# Altium schematic sheet SoM.SchDoc
size A3; SheetNumber: 1; SheetTotal: 1; PageSetup: Record=PageOptions|CenterHorizontal=True|CenterVertical=True|PrintScale=0.97|XCorrection=1.00|YCorrection=1.00|PrintKind=1|BorderSize=5000000|LeftOffset=0|BottomOffset=0|Orientation=2|PaperLength=2970|PaperWidth=2100|Scale=100|PaperSource=7|PrintQuality=600|MediaType=1|DitherType=10|PaperKind=A4|PrintScaleMode=1
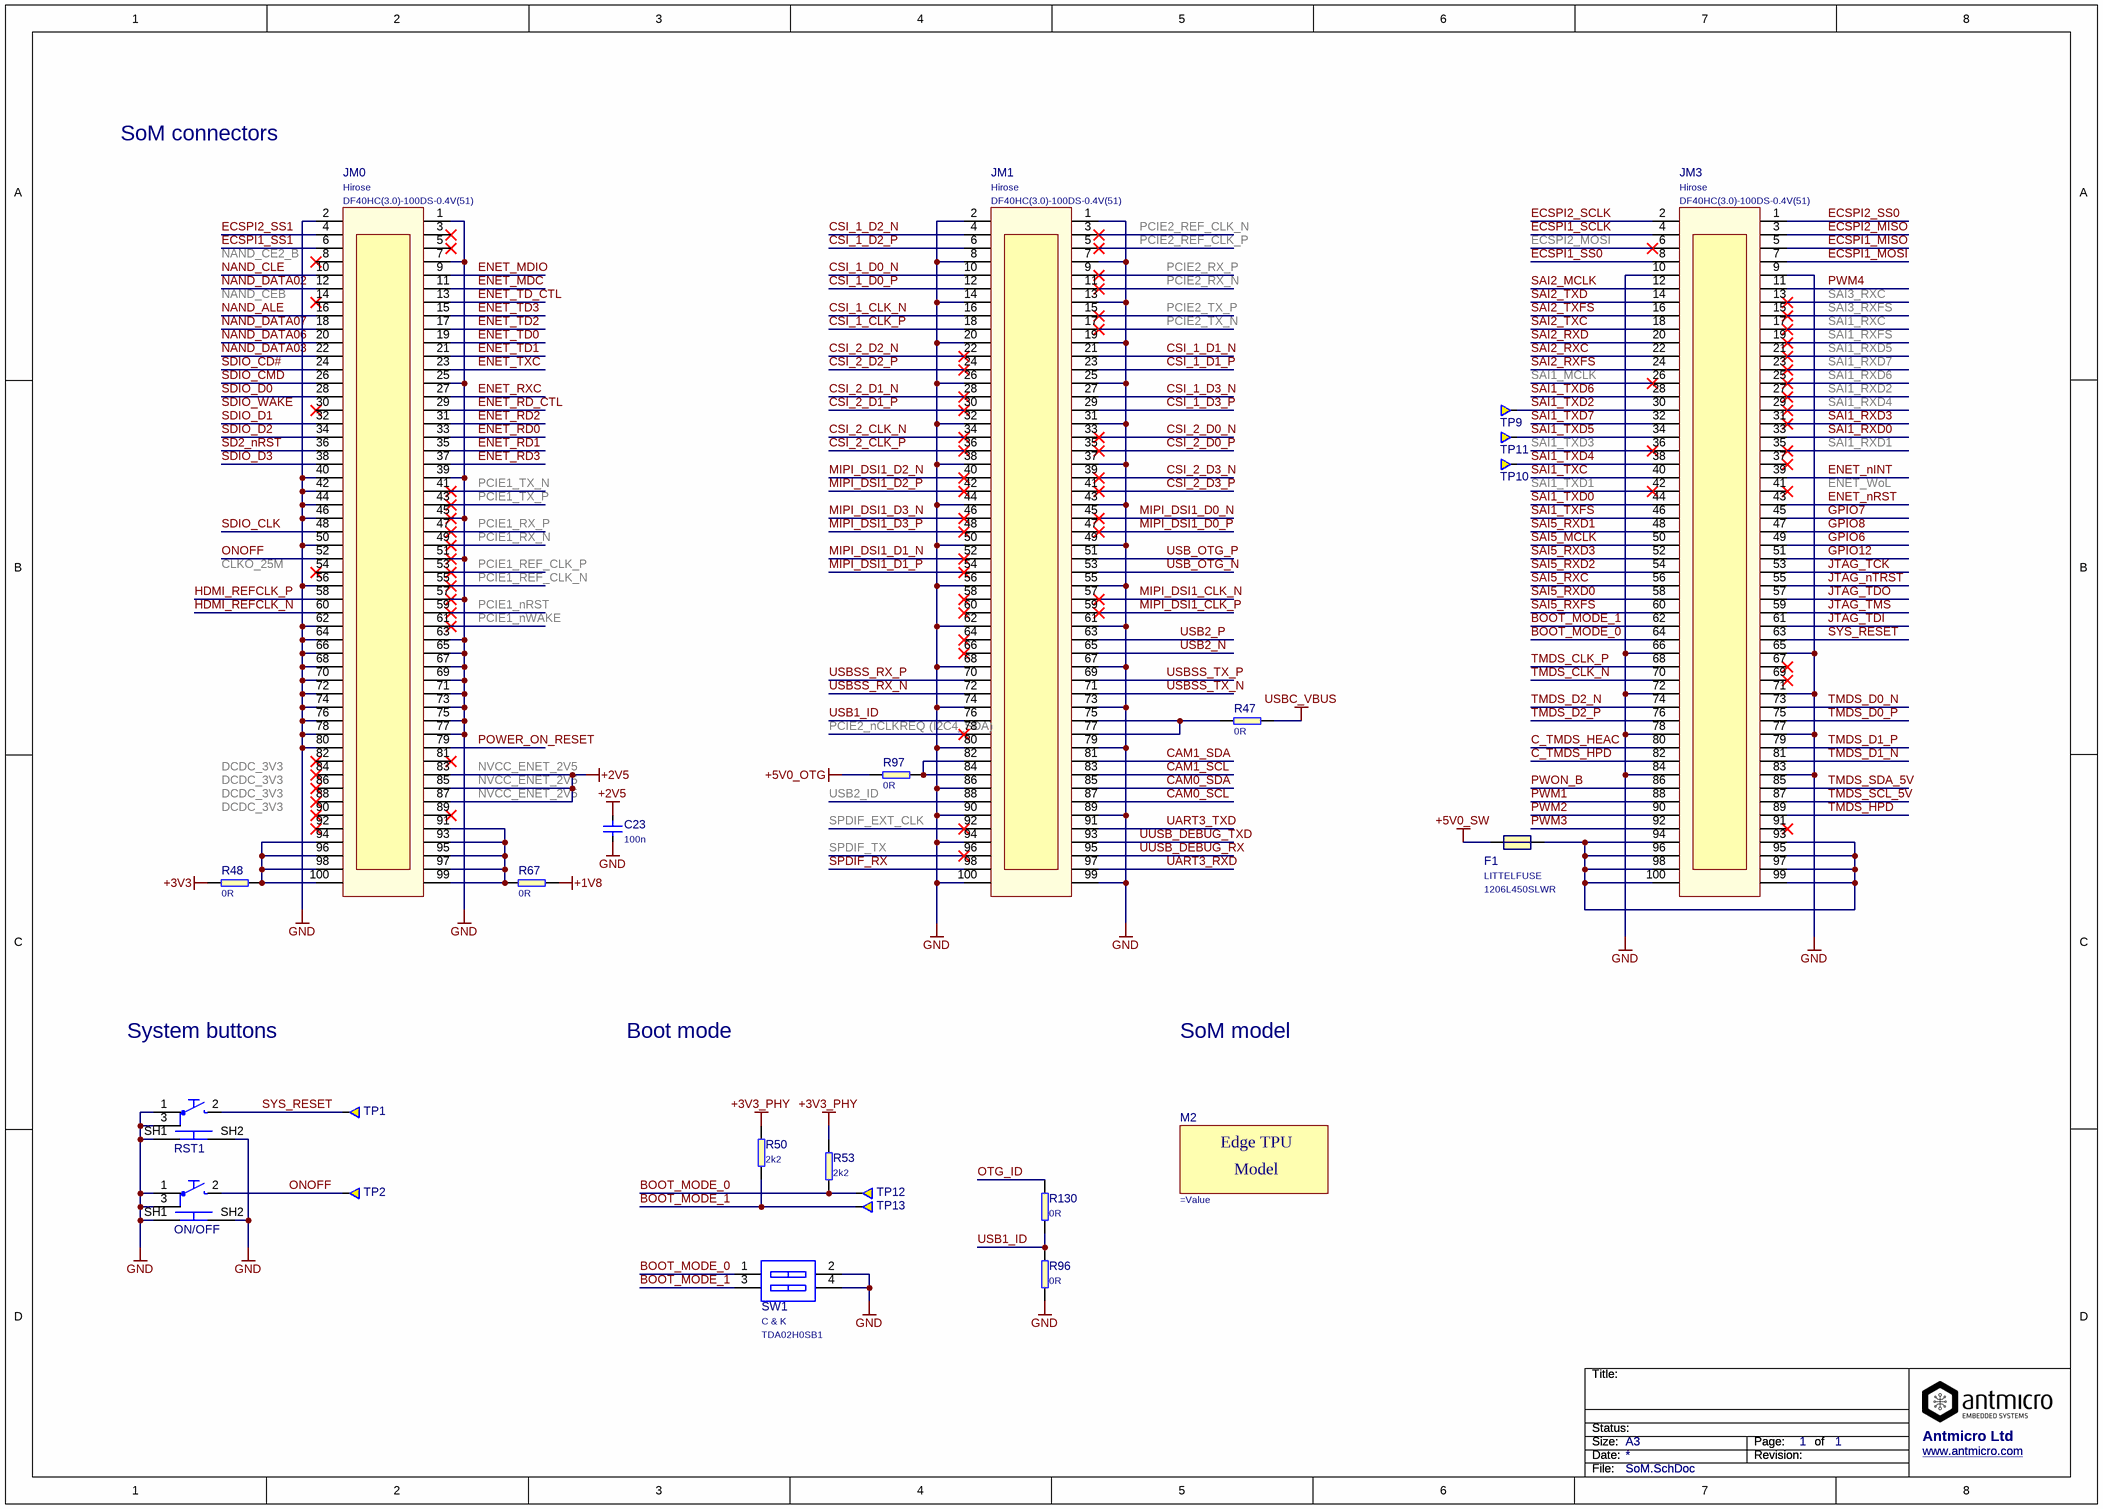
[diagram p0: SoM.SchDoc]

## Parts
C23  100n  [C_0402]
F1  PartNumber: 1206L450SLWR  Manufacturer: LITTELFUSE  [Fuse-1206]  (hidden comment: Value)
JM0  DF40HC(3.0)-100DS-0.4V(51)  Manufacturer: Hirose  [DF40HC(3.0)-100DS-0.4V(51)]
JM1  DF40HC(3.0)-100DS-0.4V(51)  Manufacturer: Hirose  [DF40HC(3.0)-100DS-0.4V(51)]
JM3  DF40HC(3.0)-100DS-0.4V(51)  Manufacturer: Hirose  [DF40HC(3.0)-100DS-0.4V(51)]
M2  (no value)  [Edge-TPU-SOM-model]
ON/OFF  TL3340AF160QG  [TL3340AF160QG]  (value not drawn)
R47  0R  [0402]
R48  0R  [0805]
R50  2k2  [0402]
R53  2k2  [0402]
R67  0R  [0805]
R96  0R  [0402]
R97  0R  [0402]
R130  0R  [0402]
RST1  TL3340AF160QG  [TL3340AF160QG]  (value not drawn)
SW1  TDA02H0SB1  Manufacturer: C & K  [TDA02H0SB1]
TP1  Testpad  [TP-R-1.5]  (value not drawn)  (no BOM)
TP2  Testpad  [TP-R-1.5]  (value not drawn)  (no BOM)
TP9  Testpad  [TP-R-1.5]  (value not drawn)  (no BOM)
TP10  Testpad  [TP-R-1.5]  (value not drawn)  (no BOM)
TP11  Testpad  [TP-R-1.5]  (value not drawn)  (no BOM)
TP12  Testpad  [TP-R-1.5]  (value not drawn)  (no BOM)
TP13  Testpad  [TP-R-1.5]  (value not drawn)  (no BOM)

## Nets
+1V8: R67.2
+3V3: R48.2
+3V3_PHY: R50.2 R53.2
+5V0_OTG: R97.2
+5V0_SW: F1.1
GND: C23.2 JM0.1(ETH_VDD) JM0.2 JM0.7(ETH_L1_C) JM0.25(PE8) JM0.39(GND) JM0.40(PC12) JM0.42(PB10) JM0.44(PB4) JM0.45(PA14) JM0.46(PG9) JM0.50(BOOT0) JM0.51(PI3) JM0.56(PB7) JM0.57(PI0) JM0.62(PB12) JM0.63(PG7) JM0.64(GND) JM0.65(PG6) JM0.66(BOOT1) JM0.67(PD3) JM0.68(PG11) JM0.69(PG10) JM0.70(PH15) JM0.71(PG12) JM0.72(PH12) JM0.73(PH13) JM0.74(PH8) JM0.75(PH9) JM0.76(PI5) JM0.77(GND) JM0.78(PI6) JM0.80(ETH_R_N) JM1.1(ETH_VDD) JM1.2 JM1.7(ETH_L1_C) JM1.8(GND) JM1.13(BATT_P) JM1.14(NRST) JM1.19(CHRG_NTC) JM1.20(PD14) JM1.25(PE8) JM1.26(PA8) JM1.31(PD5) JM1.32(PA10) JM1.37(PF0) JM1.38(PC11) JM1.43(PB3) JM1.44(PB4) JM1.49(PI2) JM1.50(BOOT0) JM1.55(PA11) JM1.56(PB7) JM1.61(PC7) JM1.62(PB12) JM1.67(PD3) JM1.68(PG11) JM1.73(PH13) JM1.74(PH8) JM1.79(PB8) JM1.80(ETH_R_N) JM1.86(PB8) JM1.89(PB8) JM1.90(PB8) JM1.94(PB8) JM1.99(PB8) JM1.100(PB8) JM3.9(GND) JM3.10(PB15) JM3.65(PG6) JM3.66(BOOT1) JM3.71(PG12) JM3.72(PH12) JM3.77(GND) JM3.78(PI6) JM3.83(PB8) JM3.84(PB8) ON/OFF.1 ON/OFF.3 ON/OFF.SH1 ON/OFF.SH2 R96.1 RST1.1 RST1.3 RST1.SH1 RST1.SH2 SW1.2 SW1.4
NVCC_ENET_2V5: C23.1 JM0.83(PB8) JM0.85(PB8) JM0.87(PB8)  [also labelled +2V5]
USBC_VBUS: R47.1
BOOT_MODE_0: JM3.64(GND) R53.1 SW1.1 TP12.1
BOOT_MODE_1: JM3.62(PB12) R50.1 SW1.3 TP13.1
C_TMDS_HEAC: JM3.80(ETH_R_N)
C_TMDS_HPD: JM3.82(PB8)
CAM0_SCL: JM1.87(PB8)
CAM0_SDA: JM1.85(PB8)
CAM1_SCL: JM1.83(PB8)
CAM1_SDA: JM1.81(PB8)
CSI_1_CLK_N: JM1.16(PE10)
CSI_1_CLK_P: JM1.18(PE9)
CSI_1_D0_N: JM1.10(PB15)
CSI_1_D0_P: JM1.12(PB14)
CSI_1_D1_N: JM1.21(1V8)
CSI_1_D1_P: JM1.23(PE7)
CSI_1_D2_N: JM1.4
CSI_1_D2_P: JM1.6
CSI_1_D3_N: JM1.27(PD1)
CSI_1_D3_P: JM1.29(PD0)
CSI_2_CLK_N: JM1.34(PC10)
CSI_2_CLK_P: JM1.36(PA15)
CSI_2_D0_N: JM1.33(PD4)
CSI_2_D0_P: JM1.35(PD7)
CSI_2_D1_N: JM1.28(GND)
CSI_2_D1_P: JM1.30(PA9)
CSI_2_D2_N: JM1.22(PD15)
CSI_2_D2_P: JM1.24(PC6)
CSI_2_D3_N: JM1.39(GND)
CSI_2_D3_P: JM1.41(RST_JTAG_O)
ECSPI1_MISO: JM3.5(ETH_T_P)
ECSPI1_MOSI: JM3.7(ETH_L1_C)
ECSPI1_SCLK: JM3.4
ECSPI1_SS0: JM3.8(GND)
ECSPI1_SS1: JM0.6
ECSPI2_MISO: JM3.3(ETH_T_N)
ECSPI2_MOSI: JM3.6
ECSPI2_SCLK: JM3.2
ECSPI2_SS0: JM3.1(ETH_VDD)
ECSPI2_SS1: JM0.4
ENET_MDC: JM0.11(BATT_P)
ENET_MDIO: JM0.9(GND)
ENET_nINT: JM3.39(GND)
ENET_nRST: JM3.43(PB3)
ENET_RD0: JM0.33(PD4)
ENET_RD1: JM0.35(PD7)
ENET_RD2: JM0.31(PD5)
ENET_RD3: JM0.37(PF0)
ENET_RD_CTL: JM0.29(PD0)
ENET_RXC: JM0.27(PD1)
ENET_TD0: JM0.19(CHRG_NTC)
ENET_TD1: JM0.21(1V8)
ENET_TD2: JM0.17(USB_VBUS)
ENET_TD3: JM0.15(USB_VBUS)
ENET_TD_CTL: JM0.13(BATT_P)
ENET_TXC: JM0.23(PE7)
GPIO6: JM3.49(PI2)
GPIO7: JM3.45(PA14)
GPIO8: JM3.47(PA13)
GPIO12: JM3.51(PI3)
HDMI_REFCLK_N: JM0.60(PI1)
HDMI_REFCLK_P: JM0.58(PB5)
JTAG_nTRST: JM3.55(PA11)
JTAG_TCK: JM3.53(PA12)
JTAG_TDI: JM3.61(PC7)
JTAG_TDO: JM3.57(PI0)
JTAG_TMS: JM3.59(PD6)
MIPI_DSI1_CLK_N: JM1.57(PI0)
MIPI_DSI1_CLK_P: JM1.59(PD6)
MIPI_DSI1_D0_N: JM1.45(PA14)
MIPI_DSI1_D0_P: JM1.47(PA13)
MIPI_DSI1_D1_N: JM1.52(PC8)
MIPI_DSI1_D1_P: JM1.54(PB6)
MIPI_DSI1_D2_N: JM1.40(PC12)
MIPI_DSI1_D2_P: JM1.42(PB10)
MIPI_DSI1_D3_N: JM1.46(PG9)
MIPI_DSI1_D3_P: JM1.48(GND)
NAND_ALE: JM0.16(PE10)
NAND_CLE: JM0.10(PB15)
NAND_DATA02: JM0.12(PB14)
NAND_DATA03: JM0.22(PD15)
NAND_DATA06: JM0.20(PD14)
NAND_DATA07: JM0.18(PE9)
ONOFF: JM0.52(PC8) ON/OFF.2 TP2.1
OTG_ID: R130.2
PCIE1_nRST: JM0.59(PD6)
PCIE1_nWAKE: JM0.61(PC7)
PCIE1_REF_CLK_N: JM0.55(PA11)
PCIE1_REF_CLK_P: JM0.53(PA12)
PCIE1_RX_N: JM0.49(PI2)
PCIE1_RX_P: JM0.47(PA13)
PCIE1_TX_N: JM0.41(RST_JTAG_O)
PCIE1_TX_P: JM0.43(PB3)
PCIE2_nCLKREQ (I2C4_SDA): JM1.78(PI6)
PCIE2_REF_CLK_N: JM1.3(ETH_T_N)
PCIE2_REF_CLK_P: JM1.5(ETH_T_P)
PCIE2_RX_N: JM1.11(BATT_P)
PCIE2_RX_P: JM1.9(GND)
PCIE2_TX_N: JM1.17(USB_VBUS)
PCIE2_TX_P: JM1.15(USB_VBUS)
POWER_ON_RESET: JM0.79(PB8)
PWM1: JM3.88(PB8)
PWM2: JM3.90(PB8)
PWM3: JM3.92(PB8)
PWM4: JM3.11(BATT_P)
PWON_B: JM3.86(PB8)
SAI1_MCLK: JM3.26(PA8)
SAI1_RXC: JM3.17(USB_VBUS)
SAI1_RXD0: JM3.33(PD4)
SAI1_RXD1: JM3.35(PD7)
SAI1_RXD2: JM3.27(PD1)
SAI1_RXD3: JM3.31(PD5)
SAI1_RXD4: JM3.29(PD0)
SAI1_RXD5: JM3.21(1V8)
SAI1_RXD6: JM3.25(PE8)
SAI1_RXD7: JM3.23(PE7)
SAI1_RXFS: JM3.19(CHRG_NTC)
SAI1_TXC: JM3.40(PC12)
SAI1_TXD0: JM3.44(PB4)
SAI1_TXD1: JM3.42(PB10)
SAI1_TXD2: JM3.30(PA9) TP9.1
SAI1_TXD3: JM3.36(PA15)
SAI1_TXD4: JM3.38(PC11) TP10.1
SAI1_TXD5: JM3.34(PC10) TP11.1
SAI1_TXD6: JM3.28(GND)
SAI1_TXD7: JM3.32(PA10)
SAI1_TXFS: JM3.46(PG9)
SAI2_MCLK: JM3.12(PB14)
SAI2_RXC: JM3.22(PD15)
SAI2_RXD: JM3.20(PD14)
SAI2_RXFS: JM3.24(PC6)
SAI2_TXC: JM3.18(PE9)
SAI2_TXD: JM3.14(NRST)
SAI2_TXFS: JM3.16(PE10)
SAI3_RXC: JM3.13(BATT_P)
SAI3_RXFS: JM3.15(USB_VBUS)
SAI5_MCLK: JM3.50(BOOT0)
SAI5_RXC: JM3.56(PB7)
SAI5_RXD0: JM3.58(PB5)
SAI5_RXD1: JM3.48(GND)
SAI5_RXD2: JM3.54(PB6)
SAI5_RXD3: JM3.52(PC8)
SAI5_RXFS: JM3.60(PI1)
SD2_nRST: JM0.36(PA15)
SDIO_CD#: JM0.24(PC6)
SDIO_CLK: JM0.48(GND)
SDIO_CMD: JM0.26(PA8)
SDIO_D0: JM0.28(GND)
SDIO_D1: JM0.32(PA10)
SDIO_D2: JM0.34(PC10)
SDIO_D3: JM0.38(PC11)
SPDIF_EXT_CLK: JM1.92(PB8)
SPDIF_RX: JM1.98(PB8)
SPDIF_TX: JM1.96(PB8)
SYS_RESET: JM3.63(PG7) RST1.2 TP1.1
TMDS_CLK_N: JM3.70(PH15)
TMDS_CLK_P: JM3.68(PG11)
TMDS_D0_N: JM3.73(PH13)
TMDS_D0_P: JM3.75(PH9)
TMDS_D1_N: JM3.81(PB8)
TMDS_D1_P: JM3.79(PB8)
TMDS_D2_N: JM3.74(PH8)
TMDS_D2_P: JM3.76(PI5)
TMDS_HPD: JM3.89(PB8)
TMDS_SCL_5V: JM3.87(PB8)
TMDS_SDA_5V: JM3.85(PB8)
UART3_RXD: JM1.97(PB8)
UART3_TXD: JM1.91(PB8)
USB1_ID: JM1.76(PI5) R96.2 R130.1
USB2_ID: JM1.88(PB8)
USB2_N: JM1.65(PG6)
USB2_P: JM1.63(PG7)
USB_OTG_N: JM1.53(PA12)
USB_OTG_P: JM1.51(PI3)
USBSS_RX_N: JM1.72(PH12)
USBSS_RX_P: JM1.70(PH15)
USBSS_TX_N: JM1.71(PG12)
USBSS_TX_P: JM1.69(PG10)
UUSB_DEBUG_RX: JM1.95(PB8)
UUSB_DEBUG_TXD: JM1.93(PB8)
NetF1_2: F1.2 JM3.93(PB8) JM3.94(PB8) JM3.95(PB8) JM3.96(PB8) JM3.97(PB8) JM3.98(PB8) JM3.99(PB8) JM3.100(PB8)
NetJM0_91: JM0.91(PB8) JM0.93(PB8) JM0.95(PB8) JM0.97(PB8) JM0.99(PB8) R67.1
NetJM0_94: JM0.94(PB8) JM0.96(PB8) JM0.98(PB8) JM0.100(PB8) R48.1
NetJM1_75: JM1.75(PH9) JM1.77(GND) R47.2
NetJM1_82: JM1.82(PB8) JM1.84(PB8) R97.1

Not connected (* = marked no-connect by the designer): JM0 3(ETH_T_N)* 5(ETH_T_P)* 8(GND)* 14(NRST)* 30(PA9)* 54(PB6)* 81(PB8)* 82(PB8)* 84(PB8)* 86(PB8)* 88(PB8)* 89(PB8)* 90(PB8)* 92(PB8)*; JM1 58(PB5)* 60(PI1)* 64(GND)* 66(BOOT1)*; JM3 37(PF0)* 41(RST_JTAG_O)* 67(PD3)* 69(PG10)* 91(PB8)*

## Notes on the sheet
- SoM connectors
- System buttons
- Boot mode
- SoM model
- Labels drawn without touching a wire or pin: CLKO_25M, DCDC_3V3, ENET_WoL, NAND_CE2_B, NAND_CEB, SDIO_WAKE
- Title:
- Size:
- Date:
- Status:
- A3
- Revision:
- Page:
- of
- Antmicro Ltd
- www.antmicro.com
- File:
- (in symbol Edge-TPU-SOM-model) Edge TPU; Model

## Library data of the parts
C23 = C_100n_0402: MLCC SMT Capacitor 100nF 0402; PartNumber: C_100n_0402; Value: 100n
F1 = LITTELFUSE_1206L450SLWR: PTC RESET 6V LO RHO 1206 4.50A; Value: 1206L450SLWR
JM0 JM1 JM3 = DF40HC(3.0)-100DS-0.4V(51): CONN RCPT 100POS 0.4MM SMD GOLD; PartNumber: DF40HC(3.0)-100DS-0.4V(51); Value: DF40HC(3.0)-100DS-0.4V(51)
M2 = Edge-TPU-SOM-model: Edge TPU SOM; PartNumber: Edge-TPU-SOM-model
ON/OFF RST1 = TL3340AF160QG: E-SWITCH  TL3340AF160QG  SWITCH, TACTILE SPST 50mA, SMD GULL WING; PartNumber: TL3340AF160QG; Value: TL3340AF160QG; Manufacturer: E-SWITCH
R47 R96 R97 R130 = R_0R_0402: SMT Resistor 0402; PartNumber: R_0R_0402; Value: 0R
R48 R67 = R_0R_0805: SMT Resistor 0R 0805; PartNumber: R_0R_0805; Value: 0R
R50 R53 = R_2k2_0402: RES, 2k2, 0402, 5%; PartNumber: R_2k2_0402; Value: 2k2
SW1 = TDA02H0SB1: TDA02H0SB1 - DIP / SIP Switch, 2 Circuits, SPST, SMD, TDA Series, DIP, 24 V; Value: TDA02H0SB1
TP1 TP2 TP9-TP13 = TP-R-1.5: Testpad, round, 1.5mm; PartNumber: Testpad